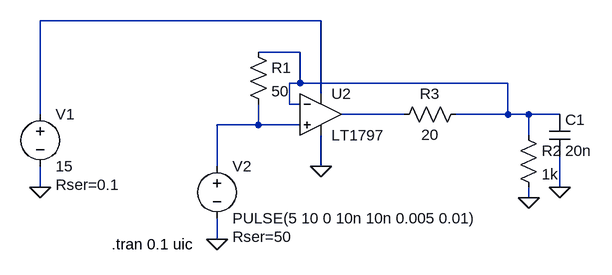
[diagram p0: schematic Draft9.asc]
Draft9.asc, the LTspice schematic file:
Version 4
SHEET 1 880 680
WIRE 240 16 -192 16
WIRE 208 64 144 64
WIRE 208 112 208 64
WIRE 208 112 192 112
WIRE 528 112 208 112
WIRE 240 128 240 16
WIRE 192 144 192 112
WIRE 208 144 192 144
WIRE -192 160 -192 16
WIRE 368 160 272 160
WIRE 528 160 528 112
WIRE 528 160 448 160
WIRE 560 160 528 160
WIRE 608 160 560 160
WIRE 144 176 144 144
WIRE 144 176 80 176
WIRE 208 176 144 176
WIRE 560 192 560 160
WIRE 80 240 80 176
WIRE 240 240 240 192
WIRE -192 272 -192 240
WIRE 608 272 608 224
WIRE 560 288 560 272
WIRE 80 352 80 320
FLAG 608 272 0
FLAG -192 272 0
FLAG 80 352 0
FLAG 240 240 0
FLAG 560 288 0
SYMBOL voltage -192 144 R0
WINDOW 123 0 0 Left 0
WINDOW 39 24 124 Left 2
SYMATTR InstName V1
SYMATTR Value 15
SYMATTR SpiceLine Rser=0.1
SYMBOL voltage 80 224 R0
WINDOW 123 0 0 Left 0
WINDOW 39 24 124 Left 2
SYMATTR InstName V2
SYMATTR Value PULSE(5 10 0 10n 10n 0.005 0.01)
SYMATTR SpiceLine Rser=50
SYMBOL cap 592 160 R0
SYMATTR InstName C1
SYMATTR Value 20n
SYMATTR SpiceLine Rser=0.1
SYMBOL res 128 48 R0
SYMATTR InstName R1
SYMATTR Value 50
SYMBOL Opamps\\LT1797 240 96 R0
SYMATTR InstName U2
SYMBOL res 544 176 R0
SYMATTR InstName R2
SYMATTR Value 1k
SYMBOL res 464 144 R90
WINDOW 0 0 56 VBottom 2
WINDOW 3 32 56 VTop 2
SYMATTR InstName R3
SYMATTR Value 20
TEXT -82 360 Left 2 !.tran 0.1 uic

The netlist it stands for:
* Draft9.asc
V1 N001 0 15 Rser=0.1
V2 N004 0 PULSE(5 10 0 10n 10n 0.005 0.01) Rser=50
C1 N002 0 20n Rser=0.1
R1 N002 N004 50
XU2 N004 N002 N001 0 N003 LT1797  ; pins In+ In- V+ V- OUT
R2 N002 0 1k
R3 N002 N003 20
.tran 0.1 uic
.backanno
.end